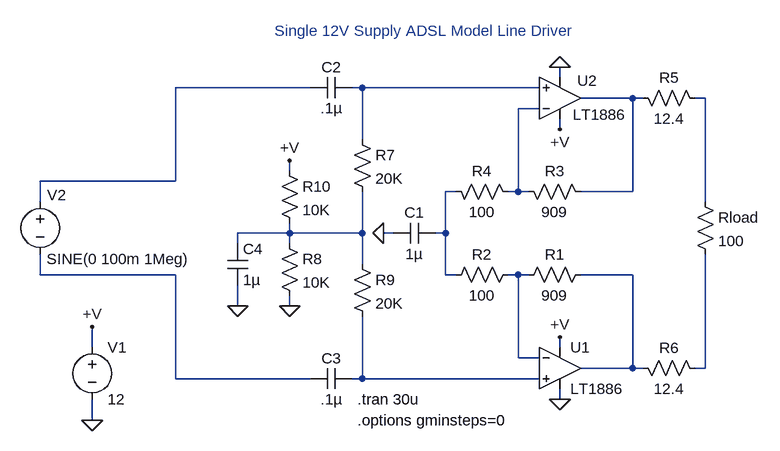
[diagram p0: schematic 1886.asc]
1886.asc, the LTspice schematic file:
Version 4
SHEET 1 896 680
WIRE 192 -192 192 -208
WIRE -192 -176 -400 -176
WIRE -112 -176 -128 -176
WIRE 160 -176 -112 -176
WIRE 304 -160 224 -160
WIRE 320 -160 304 -160
WIRE 416 -160 400 -160
WIRE 160 -144 128 -144
WIRE 192 -112 192 -128
WIRE -112 -96 -112 -176
WIRE -224 -48 -224 -64
WIRE -400 -32 -400 -176
WIRE -400 -32 -608 -32
WIRE 32 -16 16 -16
WIRE 128 -16 128 -144
WIRE 128 -16 112 -16
WIRE 144 -16 128 -16
WIRE 304 -16 304 -160
WIRE 304 -16 224 -16
WIRE -608 0 -608 -32
WIRE 416 0 416 -160
WIRE -224 48 -224 32
WIRE -224 48 -304 48
WIRE -112 48 -112 -16
WIRE -112 48 -224 48
WIRE -64 48 -80 48
WIRE 16 48 16 -16
WIRE 16 48 0 48
WIRE -304 64 -304 48
WIRE -224 64 -224 48
WIRE -112 96 -112 48
WIRE -608 112 -608 80
WIRE -400 112 -608 112
WIRE 16 112 16 48
WIRE 32 112 16 112
WIRE 128 112 112 112
WIRE 144 112 128 112
WIRE 304 112 224 112
WIRE -304 160 -304 128
WIRE -288 160 -304 160
WIRE -224 160 -224 144
WIRE -528 224 -528 192
WIRE 192 224 192 208
WIRE 128 240 128 112
WIRE 160 240 128 240
WIRE 304 256 304 112
WIRE 304 256 224 256
WIRE 320 256 304 256
WIRE 416 256 416 80
WIRE 416 256 400 256
WIRE -400 272 -400 112
WIRE -192 272 -400 272
WIRE -112 272 -112 176
WIRE -112 272 -128 272
WIRE 160 272 -112 272
WIRE 192 304 192 288
WIRE -528 336 -528 304
FLAG -528 336 0
FLAG 192 208 +V
FLAG -528 192 +V
FLAG 192 304 0
FLAG 192 -112 +V
FLAG 192 -208 0
FLAG -80 48 0
FLAG -224 -64 +V
FLAG -224 160 0
FLAG -304 160 0
SYMBOL voltage -528 208 R0
SYMATTR InstName V1
SYMATTR Value 12
SYMBOL res 240 96 R90
WINDOW 0 0 56 VBottom 0
WINDOW 3 32 56 VTop 0
SYMATTR InstName R1
SYMATTR Value 909
SYMBOL res 128 96 R90
WINDOW 0 0 56 VBottom 0
WINDOW 3 32 56 VTop 0
SYMATTR InstName R2
SYMATTR Value 100
SYMBOL opamps\\LT1886 192 192 R0
SYMATTR InstName U1
SYMBOL res 240 0 M270
WINDOW 0 32 56 VTop 0
WINDOW 3 0 56 VBottom 0
SYMATTR InstName R3
SYMATTR Value 909
SYMBOL res 128 0 M270
WINDOW 0 32 56 VTop 0
WINDOW 3 0 56 VBottom 0
SYMATTR InstName R4
SYMATTR Value 100
SYMBOL opamps\\LT1886 192 -96 M180
WINDOW 0 27 91 Left 0
WINDOW 3 20 39 Left 0
SYMATTR InstName U2
SYMBOL cap 0 32 R90
WINDOW 0 0 32 VBottom 0
WINDOW 3 32 32 VTop 0
SYMATTR InstName C1
SYMATTR Value 1µ
SYMBOL res 416 -144 M270
WINDOW 0 32 56 VTop 0
WINDOW 3 0 56 VBottom 0
SYMATTR InstName R5
SYMATTR Value 12.4
SYMBOL res 416 272 M270
WINDOW 0 32 56 VTop 0
WINDOW 3 0 56 VBottom 0
SYMATTR InstName R6
SYMATTR Value 12.4
SYMBOL res 400 -16 R0
SYMATTR InstName Rload
SYMATTR Value 100
SYMBOL res -128 -112 R0
SYMATTR InstName R7
SYMATTR Value 20K
SYMBOL res -240 48 R0
SYMATTR InstName R8
SYMATTR Value 10K
SYMBOL res -128 80 R0
SYMATTR InstName R9
SYMATTR Value 20K
SYMBOL res -240 -64 R0
SYMATTR InstName R10
SYMATTR Value 10K
SYMBOL cap -128 -192 R90
WINDOW 0 0 32 VBottom 0
WINDOW 3 32 32 VTop 0
SYMATTR InstName C2
SYMATTR Value .1µ
SYMBOL cap -128 256 R90
WINDOW 0 0 32 VBottom 0
WINDOW 3 32 32 VTop 0
SYMATTR InstName C3
SYMATTR Value .1µ
SYMBOL voltage -608 -16 R0
WINDOW 0 11 5 Left 0
WINDOW 3 10 104 Left 0
WINDOW 123 0 0 Left 0
WINDOW 39 0 0 Left 0
SYMATTR InstName V2
SYMATTR Value SINE(0 100m 1Meg)
SYMBOL cap -320 64 R0
SYMATTR InstName C4
SYMATTR Value 1µ
TEXT -16 -248 Bottom 0 ;Single 12V Supply ADSL Model Line Driver
TEXT -120 336 Left 0 !.options gminsteps=0
TEXT -120 304 Left 0 !.tran 30u

The netlist it stands for:
* 1886.asc
V1 +V 0 12
R1 N010 N009 909
R2 N009 N006 100
XU1 N012 N009 +V 0 N010 LT1886  ; pins In+ In- V+ V- OUT
R3 N003 N005 909
R4 N005 N006 100
XU2 N002 N005 +V 0 N003 LT1886  ; pins In+ In- V+ V- OUT
C1 N006 0 1µ
R5 N004 N003 12.4
R6 N011 N010 12.4
Rload N004 N011 100
R7 N002 N007 20K
R8 N007 0 10K
R9 N007 N012 20K
R10 +V N007 10K
C2 N002 N001 .1µ
C3 N012 N008 .1µ
V2 N001 N008 SINE(0 100m 1Meg)
C4 N007 0 1µ
* Single 12V Supply ADSL Model Line Driver
.options gminsteps=0
.tran 30u
.backanno
.end